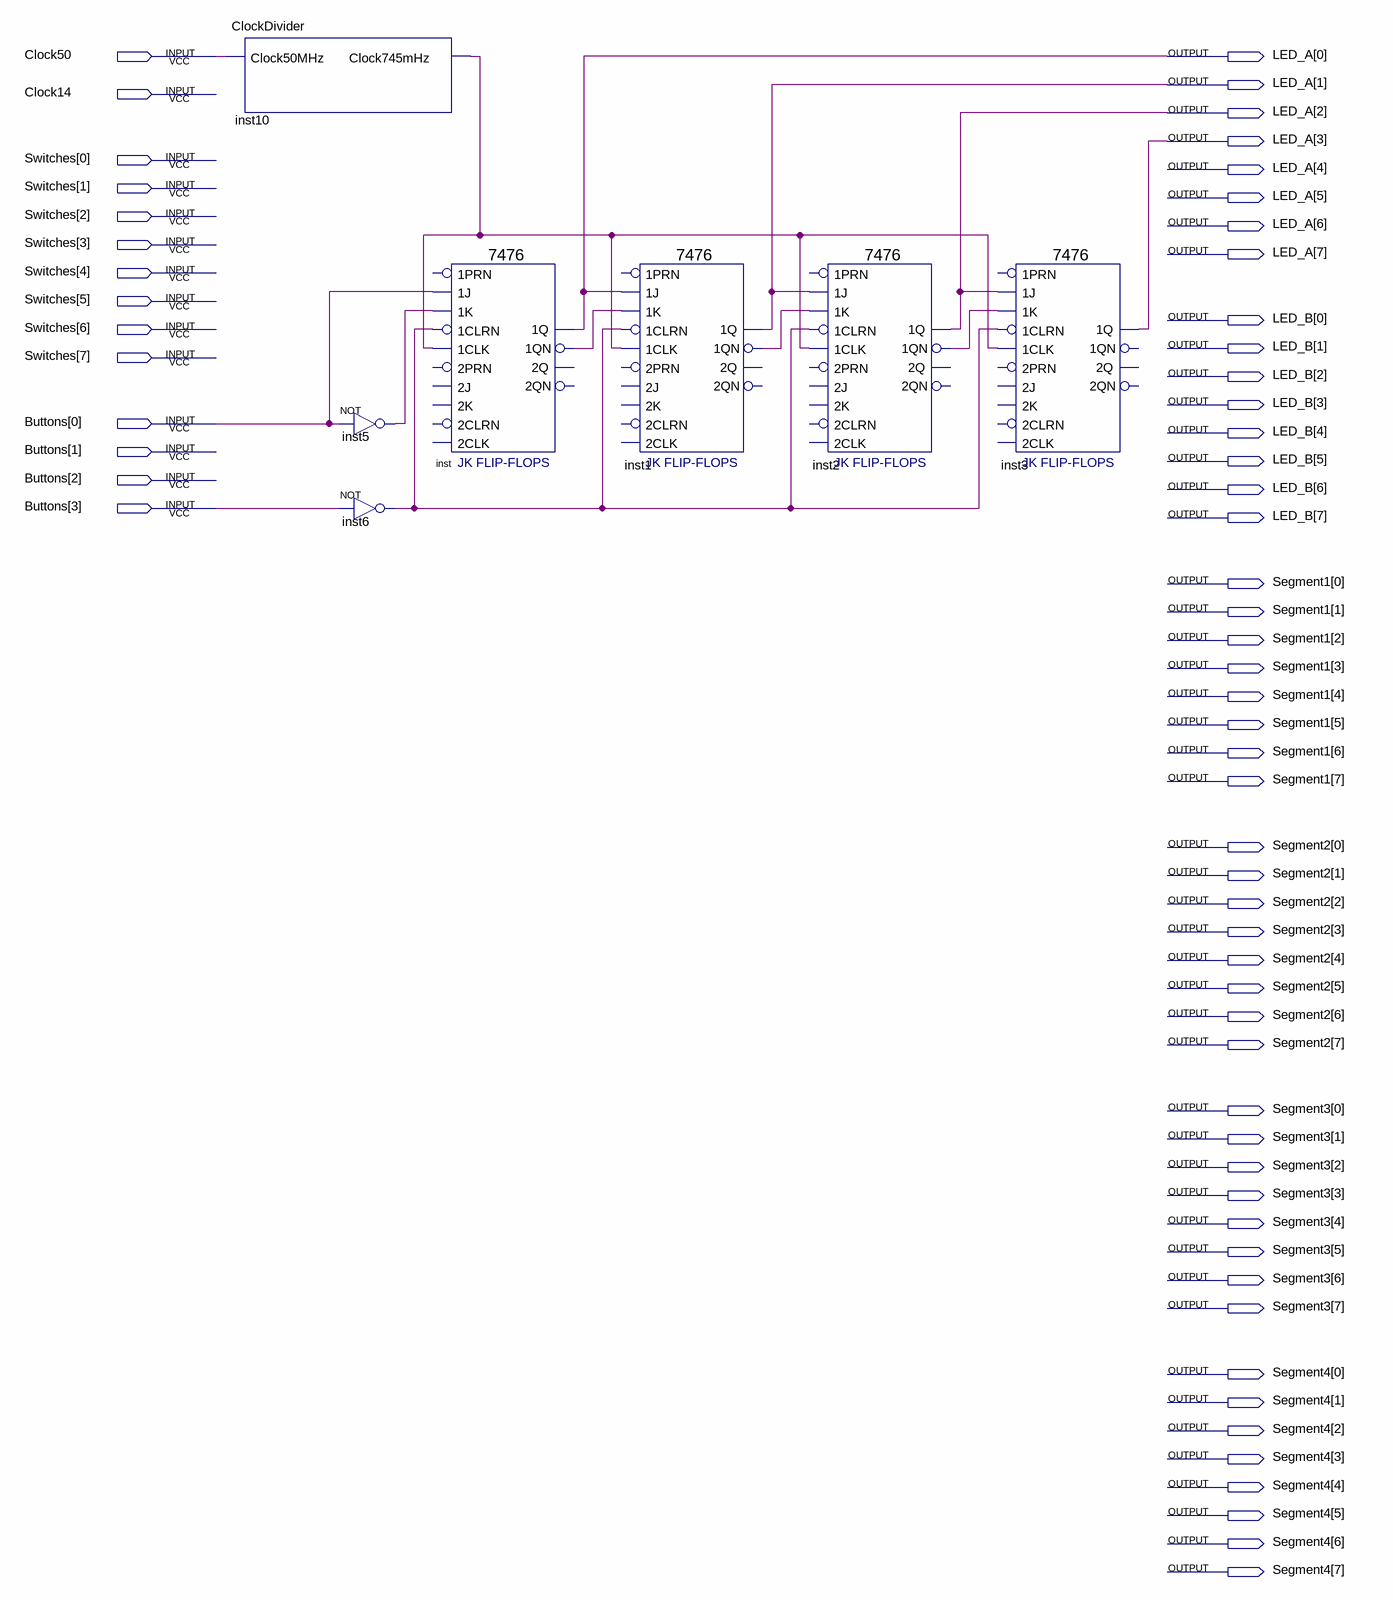
[diagram p0: schematic sheet]
// Quartus schematic Schieberegister.bdf as structural Verilog: 7 symbols, 62 pins
module Schieberegister (
  input  Clock50,
  input  Clock14,
  input  [7:0] Switches,
  input  [3:0] Buttons,
  output [7:0] LED_A,
  output [7:0] LED_B,
  output [7:0] Segment1,
  output [7:0] Segment2,
  output [7:0] Segment3,
  output [7:0] Segment4
);

  wire inst1_1qn, inst2_1qn, inst5_out, inst6_out, inst10_clock745mhz, inst_1qn;

  ClockDivider inst10 (.Clock50MHz(Clock50), .Clock745mHz(inst10_clock745mhz));
  not inst5 (inst5_out, Buttons[0]);
  not inst6 (inst6_out, Buttons[3]);
  \7476  inst (
    .\1J (Buttons[0]), .\1K (inst5_out), .\1CLK (inst10_clock745mhz), .\1CLRN (inst6_out), .\1Q (LED_A[0]),
    .\1QN (inst_1qn));  // open: 1PRN, 2PRN, 2J, 2K, 2CLRN, 2CLK, 2QN, 2Q
  \7476  inst1 (
    .\1J (LED_A[0]), .\1K (inst_1qn), .\1CLK (inst10_clock745mhz), .\1CLRN (inst6_out), .\1Q (LED_A[1]),
    .\1QN (inst1_1qn));  // open: 1PRN, 2PRN, 2J, 2K, 2CLRN, 2CLK, 2QN, 2Q
  \7476  inst2 (
    .\1J (LED_A[1]), .\1K (inst1_1qn), .\1CLK (inst10_clock745mhz), .\1CLRN (inst6_out), .\1Q (LED_A[2]),
    .\1QN (inst2_1qn));  // open: 1PRN, 2PRN, 2J, 2K, 2CLRN, 2CLK, 2QN, 2Q
  \7476  inst3 (
    .\1J (LED_A[2]), .\1K (inst2_1qn), .\1CLK (inst10_clock745mhz), .\1CLRN (inst6_out), .\1Q (LED_A[3]));  // open: 1PRN, 2PRN, 2J, 2K, 2CLRN, 2CLK, 2QN, 2Q, 1QN
endmodule
